# Altium schematic sheet Tubes4-6.SchDoc
size A
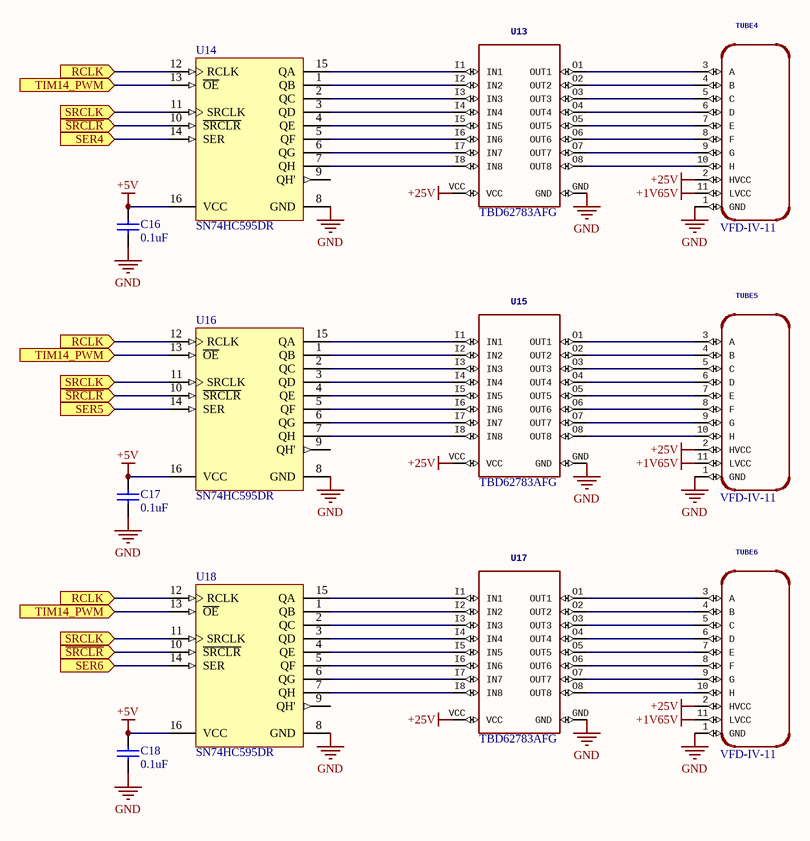
[diagram p0: Tubes4-6.SchDoc]

## Parts
C16  0.1uF  [CAPC1608X90X40ML10T20]
C17  0.1uF  [CAPC1608X90X40ML10T20]
C18  0.1uF  [CAPC1608X90X40ML10T20]
TUBE4  VFD-IV-11  [VFD-IV11]
TUBE5  VFD-IV-11  [VFD-IV11]
TUBE6  VFD-IV-11  [VFD-IV11]
U13  TBD62783AFG  [TBD62783AFG]
U14  SN74HC595DR  [D0016A_N]
U15  TBD62783AFG  [TBD62783AFG]
U16  SN74HC595DR  [D0016A_N]
U17  TBD62783AFG  [TBD62783AFG]
U18  SN74HC595DR  [D0016A_N]

## Ports
RCLK (in), SER4 (in), SER5 (in), SER6 (in), SRCLK (in), TIM14_PWM (in), ~{SRCLR} (in)

## Nets
+1V65V: TUBE4.11(LVCC) TUBE5.11(LVCC) TUBE6.11(LVCC)
+5V: C16.2 C17.2 C18.2 U14.16(VCC) U16.16(VCC) U18.16(VCC)
+25V: TUBE4.2(HVCC) TUBE5.2(HVCC) TUBE6.2(HVCC) U13.VCC U15.VCC U17.VCC
GND: C16.1 C17.1 C18.1 TUBE4.1(GND) TUBE5.1(GND) TUBE6.1(GND) U13.GND U14.8(GND) U15.GND U16.8(GND) U17.GND U18.8(GND)
~{SRCLR}: U14.10(~{SRCLR}) U16.10(~{SRCLR}) U18.10(~{SRCLR}) ; port ~{SRCLR}
RCLK: U14.12(RCLK) U16.12(RCLK) U18.12(RCLK) ; port RCLK
SER4: U14.14(SER) ; port SER4
SER5: U16.14(SER) ; port SER5
SER6: U18.14(SER) ; port SER6
SRCLK: U14.11(SRCLK) U16.11(SRCLK) U18.11(SRCLK) ; port SRCLK
TIM14_PWM: U14.13(~{OE}) U16.13(~{OE}) U18.13(~{OE}) ; port TIM14_PWM
NetTUBE4_3: TUBE4.3(A) U13.O1(OUT1)
NetTUBE4_4: TUBE4.4(B) U13.O2(OUT2)
NetTUBE4_5: TUBE4.5(C) U13.O3(OUT3)
NetTUBE4_6: TUBE4.6(D) U13.O4(OUT4)
NetTUBE4_7: TUBE4.7(E) U13.O5(OUT5)
NetTUBE4_8: TUBE4.8(F) U13.O6(OUT6)
NetTUBE4_9: TUBE4.9(G) U13.O7(OUT7)
NetTUBE4_10: TUBE4.10(H) U13.O8(OUT8)
NetTUBE5_3: TUBE5.3(A) U15.O1(OUT1)
NetTUBE5_4: TUBE5.4(B) U15.O2(OUT2)
NetTUBE5_5: TUBE5.5(C) U15.O3(OUT3)
NetTUBE5_6: TUBE5.6(D) U15.O4(OUT4)
NetTUBE5_7: TUBE5.7(E) U15.O5(OUT5)
NetTUBE5_8: TUBE5.8(F) U15.O6(OUT6)
NetTUBE5_9: TUBE5.9(G) U15.O7(OUT7)
NetTUBE5_10: TUBE5.10(H) U15.O8(OUT8)
NetTUBE6_3: TUBE6.3(A) U17.O1(OUT1)
NetTUBE6_4: TUBE6.4(B) U17.O2(OUT2)
NetTUBE6_5: TUBE6.5(C) U17.O3(OUT3)
NetTUBE6_6: TUBE6.6(D) U17.O4(OUT4)
NetTUBE6_7: TUBE6.7(E) U17.O5(OUT5)
NetTUBE6_8: TUBE6.8(F) U17.O6(OUT6)
NetTUBE6_9: TUBE6.9(G) U17.O7(OUT7)
NetTUBE6_10: TUBE6.10(H) U17.O8(OUT8)
NetU13_I1: U13.I1(IN1) U14.15(QA)
NetU13_I2: U13.I2(IN2) U14.1(QB)
NetU13_I3: U13.I3(IN3) U14.2(QC)
NetU13_I4: U13.I4(IN4) U14.3(QD)
NetU13_I5: U13.I5(IN5) U14.4(QE)
NetU13_I6: U13.I6(IN6) U14.5(QF)
NetU13_I7: U13.I7(IN7) U14.6(QG)
NetU13_I8: U13.I8(IN8) U14.7(QH)
NetU15_I1: U15.I1(IN1) U16.15(QA)
NetU15_I2: U15.I2(IN2) U16.1(QB)
NetU15_I3: U15.I3(IN3) U16.2(QC)
NetU15_I4: U15.I4(IN4) U16.3(QD)
NetU15_I5: U15.I5(IN5) U16.4(QE)
NetU15_I6: U15.I6(IN6) U16.5(QF)
NetU15_I7: U15.I7(IN7) U16.6(QG)
NetU15_I8: U15.I8(IN8) U16.7(QH)
NetU17_I1: U17.I1(IN1) U18.15(QA)
NetU17_I2: U17.I2(IN2) U18.1(QB)
NetU17_I3: U17.I3(IN3) U18.2(QC)
NetU17_I4: U17.I4(IN4) U18.3(QD)
NetU17_I5: U17.I5(IN5) U18.4(QE)
NetU17_I6: U17.I6(IN6) U18.5(QF)
NetU17_I7: U17.I7(IN7) U18.6(QG)
NetU17_I8: U17.I8(IN8) U18.7(QH)

Not connected (* = marked no-connect by the designer): U14 9(QH'); U16 9(QH'); U18 9(QH')

## Library data of the parts
C16-C18 = CMP-2000-05002-1: Ceramic Multilayer Capacitor, 100 nF, +/- 10%, 50 V, -55 to 155 degC, 0603 (1608 Metric), RoHS, Tape and Reel; Manufacturer: Yageo; Online Catalog: CCSeries; Voltage - Rated: 16V; Product Training Modules: MultilayerCeramicCapacitors; Other Names: 311-1088-6; Featured Product: CommodityMultilayerCeramicCapacitors–CCSeries; Capacitance: 0.1µF; Temperature Coefficient: X7R; Height - Seated (Max): -; Operating Temperature: -55degC~125degC; Package / Case: 0603(1608Metric); Datasheet URL: https://datasheet.ciiva.com/11786/0900766b80d84f1d-11786077.pdf; Package Description: 2-Pin Surface Mount Device, Body 1.6 x 0.8 mm; Family: CeramicCapacitors; Packaging: Digi-Reel; Size / Dimension: 0.063"Lx0.031"W(1.60mmx0.80mm); Thickness (Max): 0.035"(0.90mm); Series: CC; Lead Spacing: -; Features: -; Tolerance: ±10%; Lead Style: -; Ratings: -; Manufacturer URL: http://www.yageo.com/; Package Reference: 603; Standard Package: 1; Category: Capacitors; Mounting Type: SurfaceMount,MLCC; Applications: GeneralPurpose; Datasheet Version: Rev. 2, 05/2009
TUBE4-TUBE6 = VFD-IV-11: GateName_1: G$1; SymbolName_1: VFD-IV11; LibraryName: VFD-Clock; DeviceSetName: VFD-IV-11; Package: VFD-IV11
U13 = TBD62783AFG: TUBE4; GateName_1: G$1; SymbolName_1: TBD62783AFG; LibraryName: TBD62783AFG; DeviceSetName: TBD62783AFG; Package: TBD62783AFG
U14 U16 U18 = CMP-0780-00037-3: 8-Bit Shift Registers With 3-State Output Registers, D0016A, LARGE T&R; Manufacturer: Texas Instruments; Output Drive (IOL/IOH)(Max)(mA): 7.8/-7.8; Rating: Military; ICC @ Nom Voltage(Max)(mA): 0.08; VCC(Min)(V): 2; tpd @ Nom Voltage(Max)(ns): 34; 3-State Output: Yes; Output Type: CMOS; Voltage(Nom)(V): 6; F @ Nom Voltage(Max)(Mhz): 28; Technology Family: HC; Bits: 4; PackageReference: D0016A; Code_JEDEC: MS-012 variation AC; Generic Part Number: SN74HC595; Operating Temperature Range(C): -40 to 85; DatasheetVersion: SCLS041H; PackageVersion: http://www.ti.com/lit/ml/mpds178g/mpds178g.pdf; Input Type: CMOS; VCC(Max)(V): 6
U15 = TBD62783AFG: TUBE5; GateName_1: G$1; SymbolName_1: TBD62783AFG; LibraryName: TBD62783AFG; DeviceSetName: TBD62783AFG; Package: TBD62783AFG
U17 = TBD62783AFG: TUBE6; GateName_1: G$1; SymbolName_1: TBD62783AFG; LibraryName: TBD62783AFG; DeviceSetName: TBD62783AFG; Package: TBD62783AFG